# Altium schematic sheet Thermocouples.SchDoc
size Letter; Organization: Altium Limited; Address1: L3, 12a Rodborough Rd; Address2: Frenchs Forest; Address3: NSW; Address4: Australia 2086
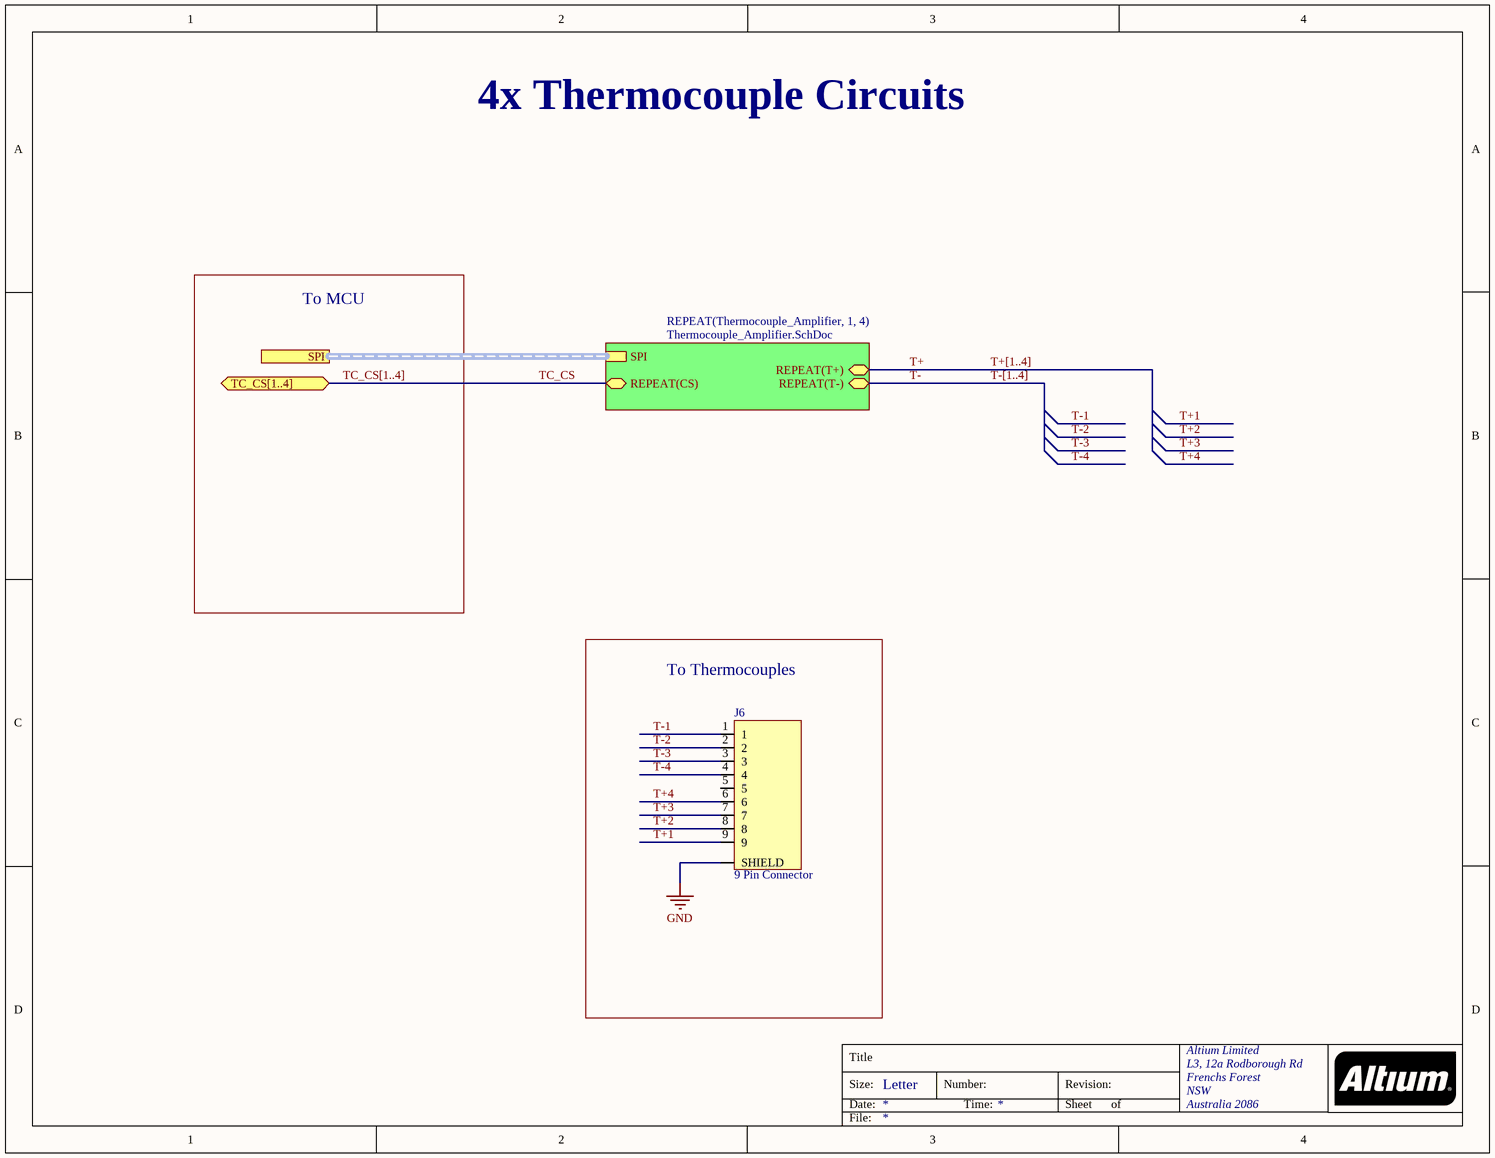
[diagram p0: Thermocouples.SchDoc]

## Parts
J6  9 Pin Connector  [9-Pos D-Sub]

## Blocks framed on the sheet
To Thermocouples: J6

## Sub-sheets
REPEAT(Thermocouple_Amplifier, 1, 4) = Thermocouple_Amplifier.SchDoc: SPI (harness SPI), REPEAT(CS) (bidir), REPEAT(T+) (bidir), REPEAT(T-) (bidir)

## Ports
SPI (harness SPI), TC_CS[1..4] (bidir)

## Nets
GND: J6.SHIELD
T+: sheet REPEAT(Thermocouple_Amplifier, 1, 4)/REPEAT(T+)
T+1: J6.9
T+2: J6.8
T+3: J6.7
T+4: J6.6
T-: sheet REPEAT(Thermocouple_Amplifier, 1, 4)/REPEAT(T-)
T-1: J6.1
T-2: J6.2
T-3: J6.3
T-4: J6.4
TC_CS: sheet REPEAT(Thermocouple_Amplifier, 1, 4)/REPEAT(CS)

Not connected (* = marked no-connect by the designer): J6 5

## Buses and harness runs
bus T+[1..4]
bus T-[1..4]
bus TC_CS[1..4] = port TC_CS[1..4]
harness port SPI = sheet REPEAT(Thermocouple_Amplifier, 1, 4)/SPI

## Notes on the sheet
- 4x Thermocouple Circuits
- To MCU
- Title
- Size:
- Date:
- Letter
- Number:
- Time:
- Revision:
- Sheet
- of
- File:

## Library data of the parts
J6 = 9-Position Connector: Unknown parameter: 772-E09-213R011